# Altium schematic sheet 13_Nand_Flash.SchDoc
size 297 x 209 mm
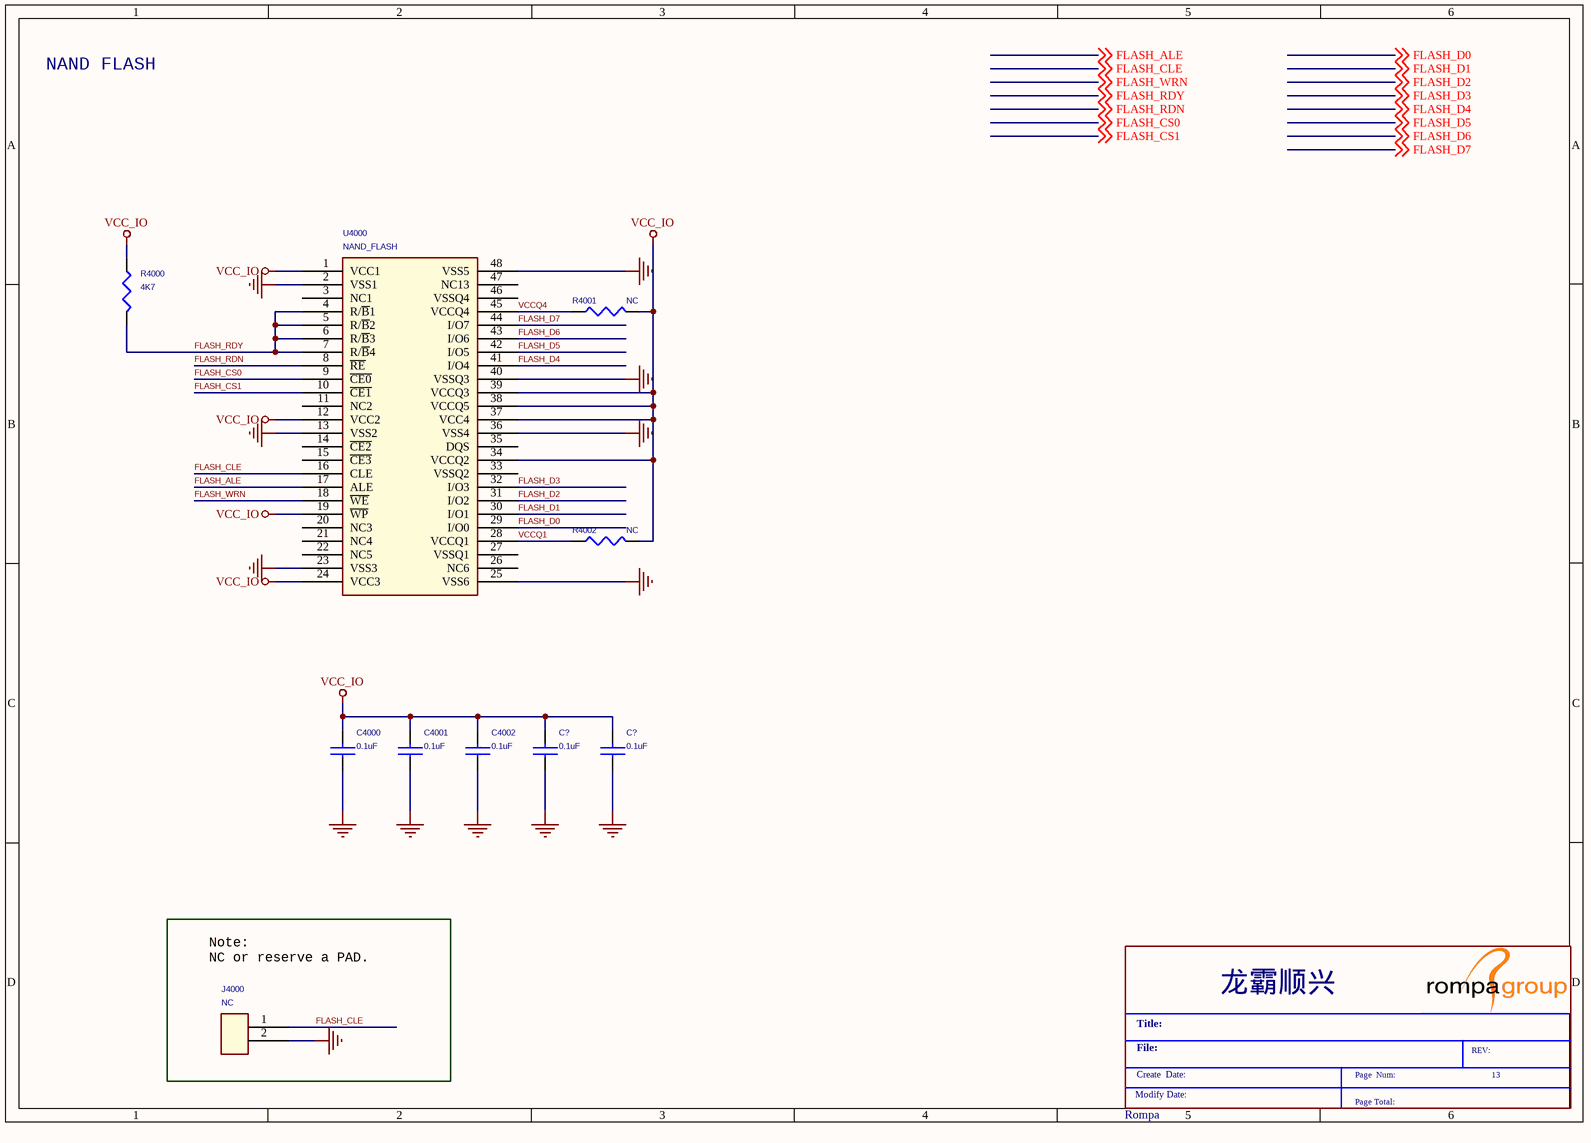
[diagram p0: 13_Nand_Flash.SchDoc]

## Parts
(Parts that share a designator on the sheet are numbered #1, #2 ... from top to bottom, then left to right.)
*  Rompa  Schematic Page Number: 13  (graphical)
C4000  0.1uF  [C0402]
C4001  0.1uF  [C0402]
C4002  0.1uF  [C0402]
C?#1  0.1uF  [C0402]
C?#2  0.1uF  [C0402]
J4000  NC  [R0603]
R4000  4K7  [R0402]
R4001  NC  [R0402]
R4002  NC  [R0402]
U4000  NAND_FLASH  [TSOP1-48]

## Nets
GND: C4000.1 C4001.1 C4002.1 C?#1.1 C?#2.1 J4000.2 U4000.2(VSS1) U4000.13(VSS2) U4000.23(VSS3) U4000.25(VSS6) U4000.36(VSS4) U4000.40(VSSQ3) U4000.48(VSS5)
VCC_IO: C4000.2 C4001.2 C4002.2 C?#1.2 C?#2.2 R4000.1 R4001.2 R4002.2 U4000.1(VCC1) U4000.12(VCC2) U4000.19(~{WP}) U4000.24(VCC3) U4000.34(VCCQ2) U4000.37(VCC4) U4000.38(VCCQ5) U4000.39(VCCQ3)
FLASH_ALE: U4000.17(ALE) ; off-sheet FLASH_ALE
FLASH_CLE: J4000.1 U4000.16(CLE) ; off-sheet FLASH_CLE
FLASH_CS0: U4000.9(~{CE0}) ; off-sheet FLASH_CS0
FLASH_CS1: U4000.10(~{CE1}) ; off-sheet FLASH_CS1
FLASH_D0: U4000.29(I/O0) ; off-sheet FLASH_D0
FLASH_D1: U4000.30(I/O1) ; off-sheet FLASH_D1
FLASH_D2: U4000.31(I/O2) ; off-sheet FLASH_D2
FLASH_D3: U4000.32(I/O3) ; off-sheet FLASH_D3
FLASH_D4: U4000.41(I/O4) ; off-sheet FLASH_D4
FLASH_D5: U4000.42(I/O5) ; off-sheet FLASH_D5
FLASH_D6: U4000.43(I/O6) ; off-sheet FLASH_D6
FLASH_D7: U4000.44(I/O7) ; off-sheet FLASH_D7
FLASH_RDN: U4000.8(~{RE}) ; off-sheet FLASH_RDN
FLASH_RDY: R4000.2 U4000.4(R/~{B}1) U4000.5(R/~{B}2) U4000.6(R/~{B}3) U4000.7(R/~{B}4) ; off-sheet FLASH_RDY
FLASH_WRN: U4000.18(~{WE}) ; off-sheet FLASH_WRN
VCCQ1: R4002.1 U4000.28(VCCQ1)
VCCQ4: R4001.1 U4000.45(VCCQ4)

Not connected (* = marked no-connect by the designer): U4000 3(NC1) 11(NC2) 14(~{CE2}) 15(~{CE3}) 20(NC3) 21(NC4) 22(NC5) 26(NC6) 27(VSSQ1) 33(VSSQ2) 35(DQS) 46(VSSQ4) 47(NC13)

## Notes on the sheet
- NAND FLASH
- (near J4000) Note:
  NC or reserve a PAD.
- (in symbol Rompa) 龙霸顺兴; Title:; File:; REV:; Create  Date:; Page  Num:; Modify Date:; Page Total:

## Library data of the parts
C4000-C4002 C?#1 C?#2 = CAP NP: RoHS CHIP CAP 0.1uF +10/-10% X7R
J4000 = CON2: TEST
R4000-R4002 = RES 1B: ROHS CHIP RES 4.7K 1/16W 5%
U4000 = NANDFLASH_0: NAND Flash,2.7V,3.3V,3.6V,2G*8,N/A,-40℃~85℃,TSOP-48P